# EAGLE design swiatlo (EAGLE 7.5.0)
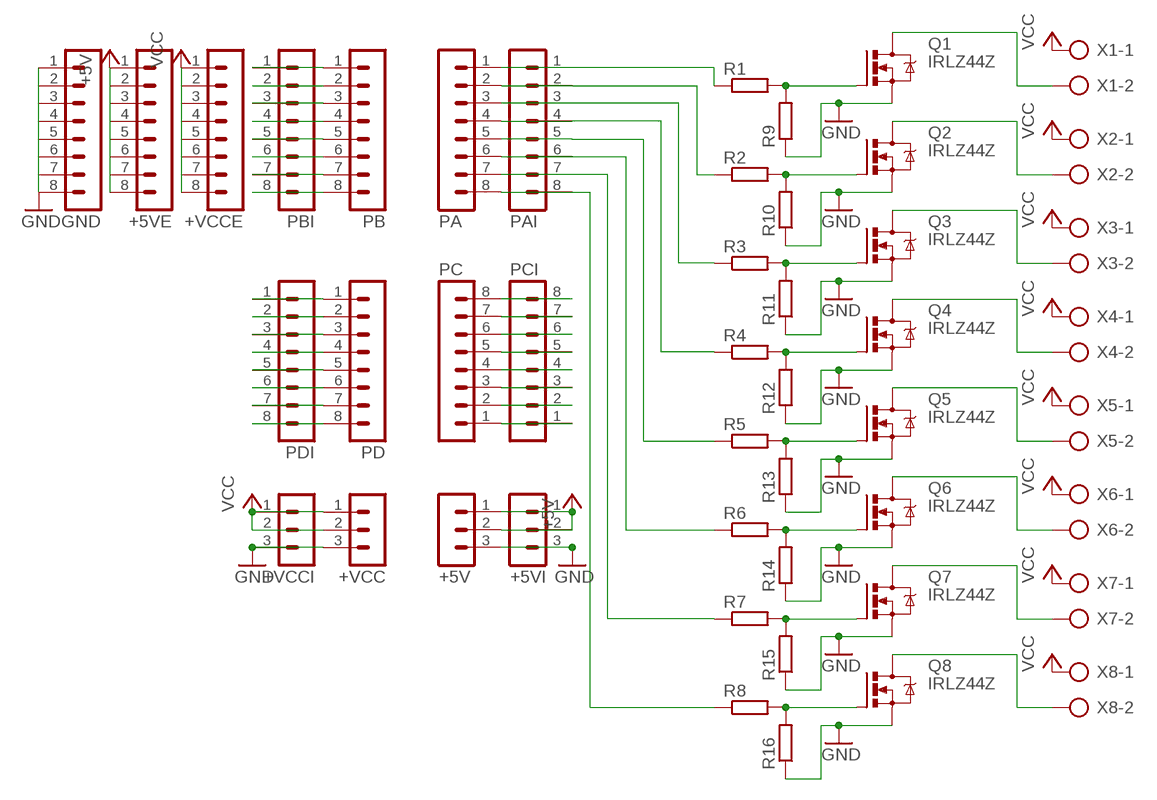
[diagram p0: schematic, sheet 1]

## Parts
+5V  MA03-1  [MA03-1]
+5VE  MA08-1  [MA08-1]
+5VI  MA03-1  [MA03-1]
+VCC  MA03-1  [MA03-1]
+VCCE  MA08-1  [MA08-1]
+VCCI  MA03-1  [MA03-1]
GND  MA08-1  [MA08-1]
PA  MA08-1  [MA08-1]
PAI  MA08-1  [MA08-1]
PB  MA08-1  [MA08-1]
PBI  MA08-1  [MA08-1]
PC  MA08-1  [MA08-1]
PCI  MA08-1  [MA08-1]
PD  MA08-1  [MA08-1]
PDI  MA08-1  [MA08-1]
Q1  IRLZ44Z  [TO220BH]
Q2  IRLZ44Z  [TO220BH]
Q3  IRLZ44Z  [TO220BH]
Q4  IRLZ44Z  [TO220BH]
Q5  IRLZ44Z  [TO220BH]
Q6  IRLZ44Z  [TO220BH]
Q7  IRLZ44Z  [TO220BH]
Q8  IRLZ44Z  [TO220BH]
R1  R-EU_0204/7  [0204/7]
R2  R-EU_0204/7  [0204/7]
R3  R-EU_0204/7  [0204/7]
R4  R-EU_0204/7  [0204/7]
R5  R-EU_0204/7  [0204/7]
R6  R-EU_0204/7  [0204/7]
R7  R-EU_0204/7  [0204/7]
R8  R-EU_0204/7  [0204/7]
R9  R-EU_0204/7  [0204/7]
R10  R-EU_0204/7  [0204/7]
R11  R-EU_0204/7  [0204/7]
R12  R-EU_0204/7  [0204/7]
R13  R-EU_0204/7  [0204/7]
R14  R-EU_0204/7  [0204/7]
R15  R-EU_0204/7  [0204/7]
R16  R-EU_0204/7  [0204/7]
X1  AK300/2  [AK300/2]
X2  AK300/2  [AK300/2]
X3  AK300/2  [AK300/2]
X4  AK300/2  [AK300/2]
X5  AK300/2  [AK300/2]
X6  AK300/2  [AK300/2]
X7  AK300/2  [AK300/2]
X8  AK300/2  [AK300/2]

## Nets
+5V: +5V.1 +5V.2 +5VE.1 +5VE.2 +5VE.3 +5VE.4 +5VE.5 +5VE.6 +5VE.7 +5VE.8 +5VI.1 +5VI.2
GND: +5V.3 +5VI.3 +VCC.3 +VCCI.3 GND.1 GND.2 GND.3 GND.4 GND.5 GND.6 GND.7 GND.8 Q1.S Q2.S Q3.S Q4.S Q5.S Q6.S Q7.S Q8.S R9.1 R10.1 R11.1 R12.1 R13.1 R14.1 R15.1 R16.1
N$1: Q1.G R1.2 R9.2
N$2: Q2.G R2.2 R10.2
N$3: Q3.G R3.2 R11.2
N$4: Q4.G R4.2 R12.2
N$5: Q5.G R5.2 R13.2
N$6: Q6.G R6.2 R14.2
N$7: Q7.G R7.2 R15.2
N$8: Q8.G R8.2 R16.2
N$9: Q1.D X1.2
N$10: Q2.D X2.2
N$11: Q3.D X3.2
N$12: Q4.D X4.2
N$13: Q5.D X5.2
N$14: Q6.D X6.2
N$15: Q7.D X7.2
N$16: Q8.D X8.2
N$25: PC.8 PCI.8
N$26: PC.7 PCI.7
N$27: PC.6 PCI.6
N$28: PC.5 PCI.5
N$29: PC.4 PCI.4
N$30: PC.3 PCI.3
N$31: PC.2 PCI.2
N$32: PC.1 PCI.1
N$33: PA.1 PAI.1 R1.1
N$34: PA.2 PAI.2 R2.1
N$35: PA.3 PAI.3 R3.1
N$36: PA.4 PAI.4 R4.1
N$37: PA.5 PAI.5 R5.1
N$38: PA.6 PAI.6 R6.1
N$39: PA.7 PAI.7 R7.1
N$40: PA.8 PAI.8 R8.1
N$47: PD.8 PDI.8
N$48: PD.7 PDI.7
N$49: PD.6 PDI.6
N$50: PD.5 PDI.5
N$51: PD.4 PDI.4
N$52: PD.3 PDI.3
N$53: PD.2 PDI.2
N$54: PD.1 PDI.1
N$55: PB.8 PBI.8
N$56: PB.7 PBI.7
N$57: PB.6 PBI.6
N$58: PB.5 PBI.5
N$59: PB.4 PBI.4
N$60: PB.3 PBI.3
N$61: PB.2 PBI.2
N$62: PB.1 PBI.1
VCC: +VCC.1 +VCC.2 +VCCE.1 +VCCE.2 +VCCE.3 +VCCE.4 +VCCE.5 +VCCE.6 +VCCE.7 +VCCE.8 +VCCI.1 +VCCI.2 X1.1 X2.1 X3.1 X4.1 X5.1 X6.1 X7.1 X8.1

## Library data of the parts
+5V +5VI +VCC +VCCI = con-lstb:MA03-1: PIN HEADER; OC_FARNELL: unknown; OC_NEWARK: unknown
+5VE +VCCE GND PA PAI PB PBI PC PCI PD PDI = con-lstb:MA08-1: PIN HEADER; OC_FARNELL: unknown; OC_NEWARK: unknown
Q1-Q8 = transistor-power:IRLZ44Z: N-Channel HEXFET® Power MOSFET Logic Level AUTOMOTIVE MOSFET Source: http://www.irf.com/product-info/datasheets/data/irlz44zpbf.pdf
R1-R16 = rcl:R-EU_: RESISTOR, European symbol
X1-X8 = con-ptr500:AK300/2: CONNECTOR; OC_FARNELL: unknown; OC_NEWARK: unknown

## Board
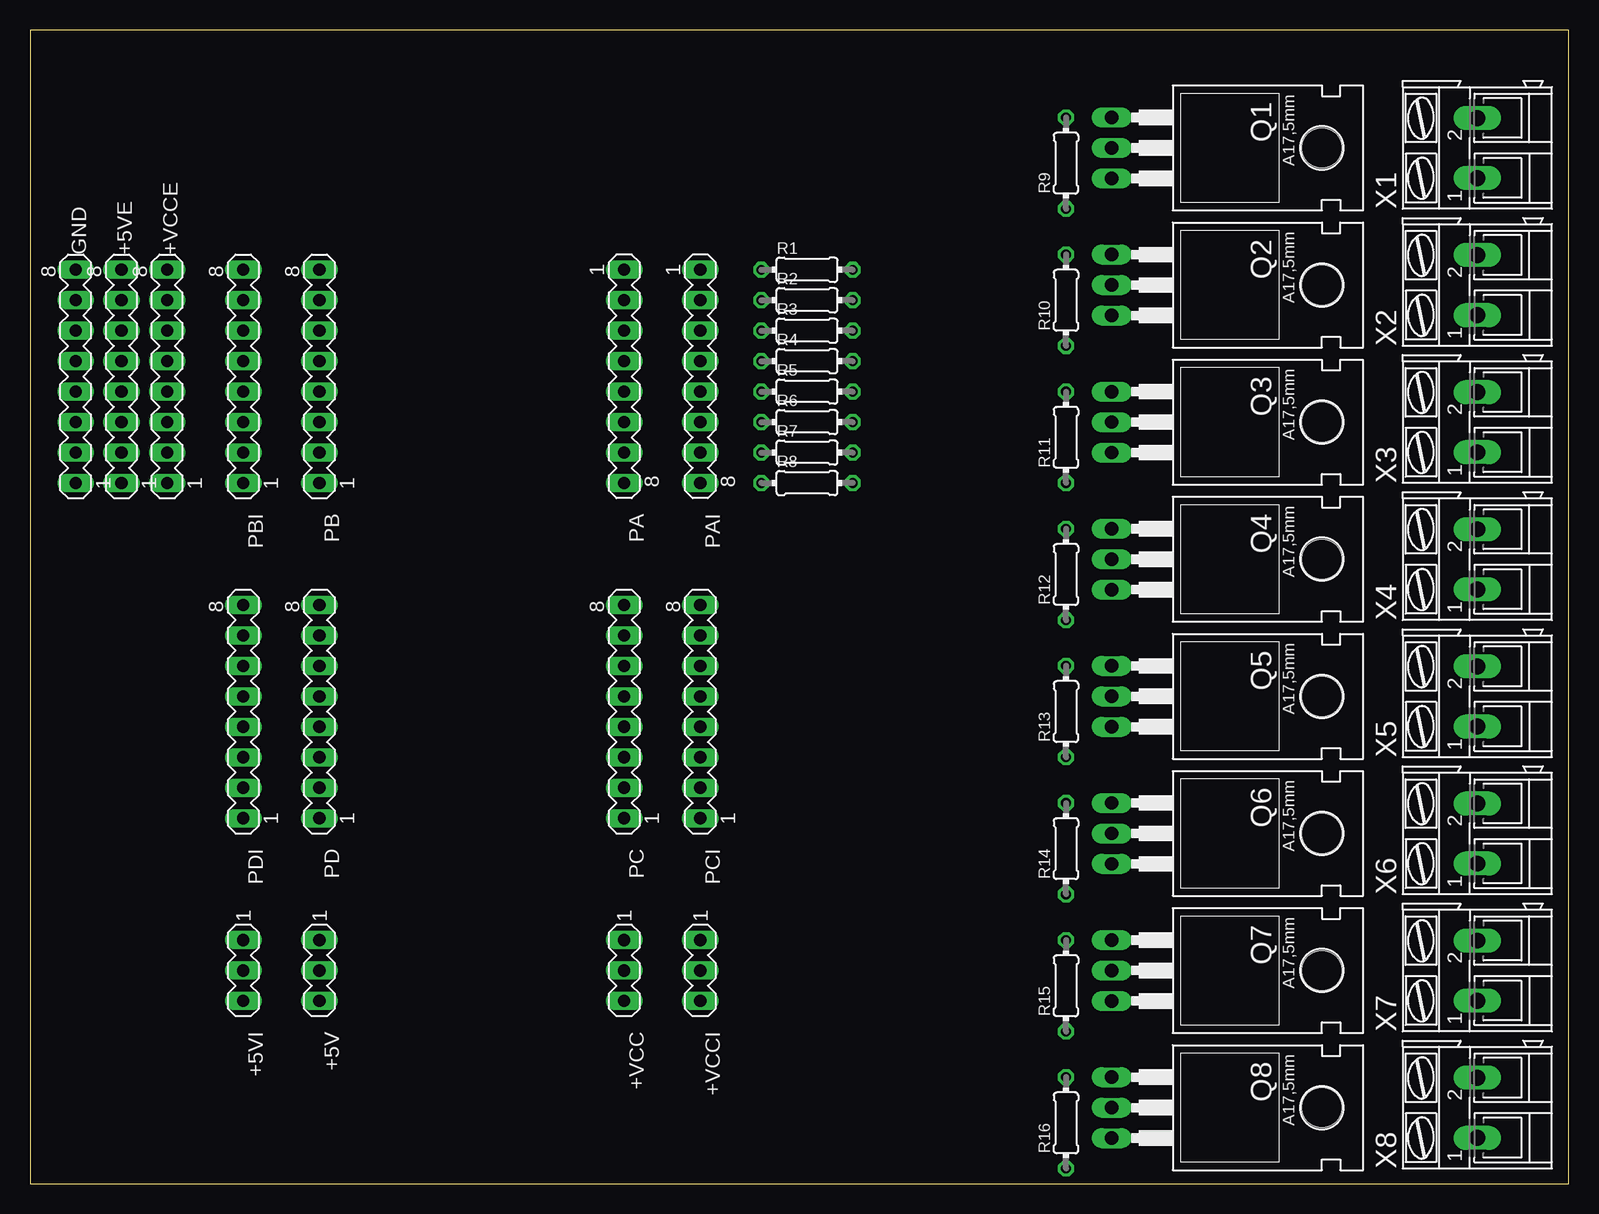
[diagram p1: board, top side]
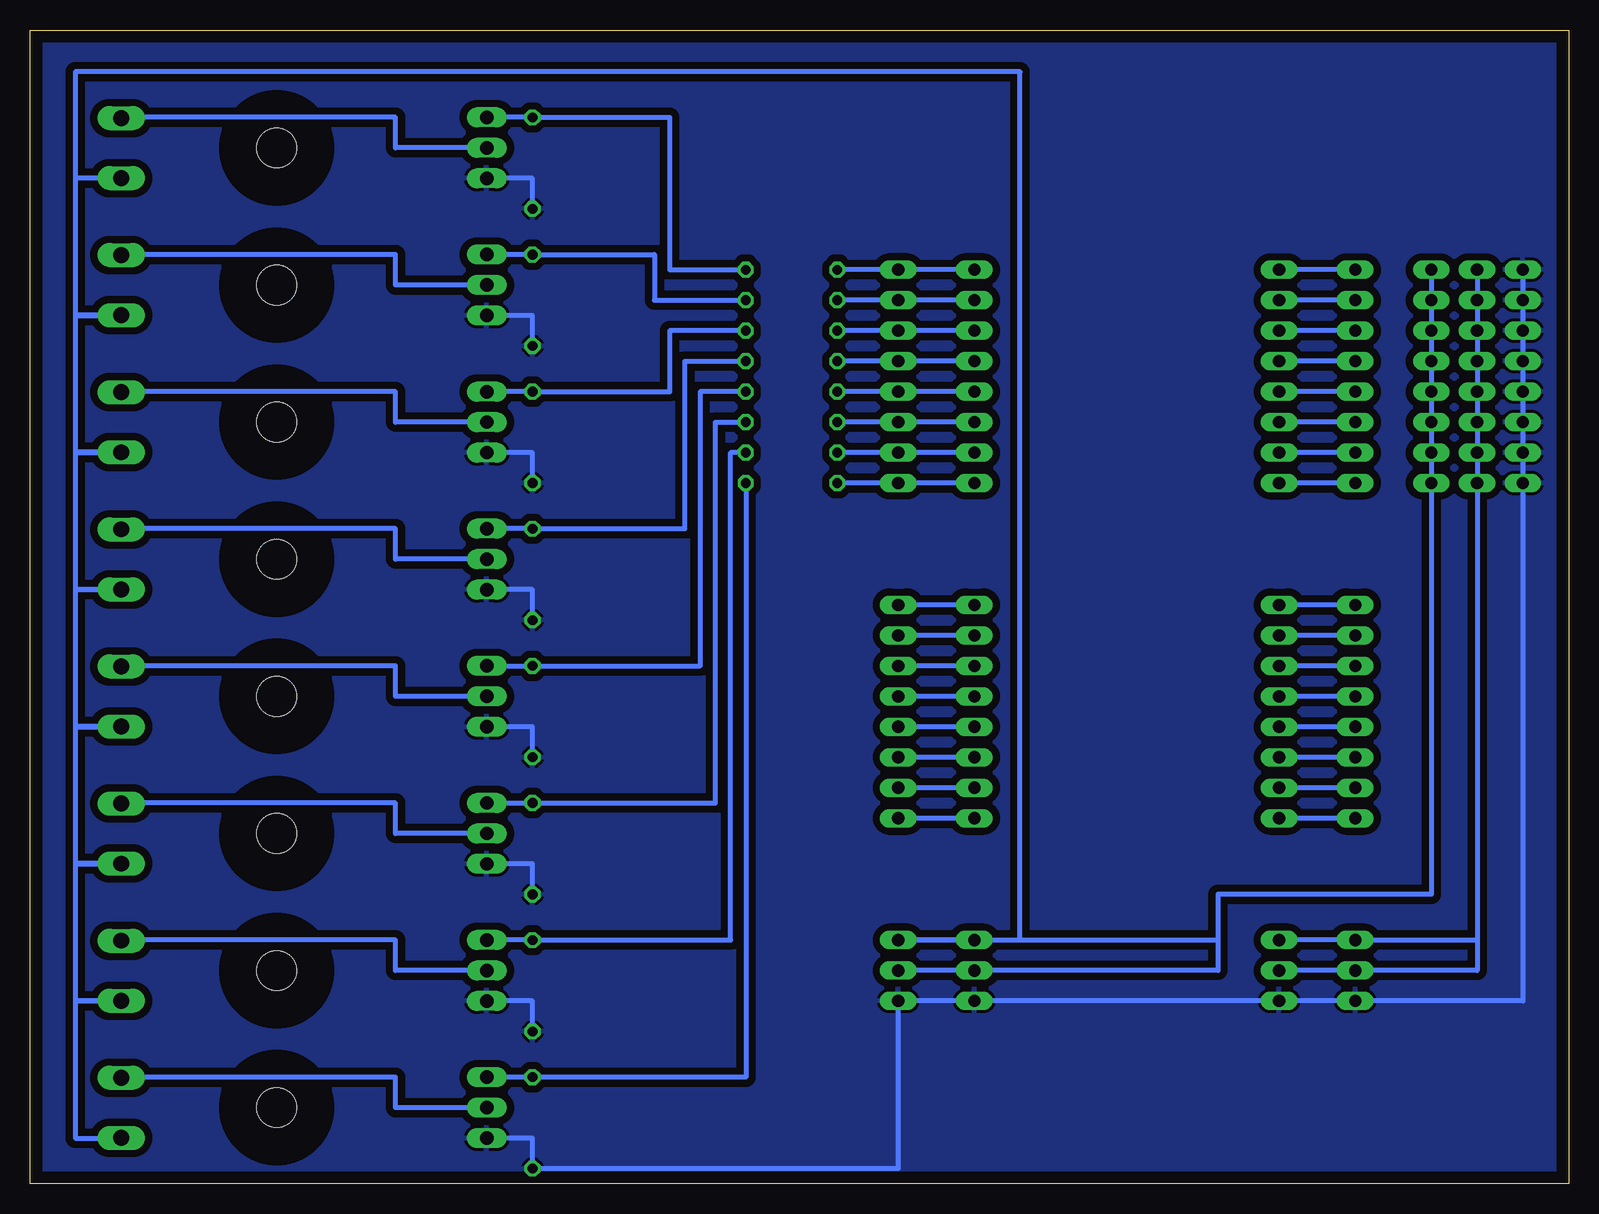
[diagram p2: board, bottom side, seen from below]

Size 128.25 x 96.19 mm. Coordinates in mm from the lower left corner, seen from the top.
Outline: 0,0 128.25,0 128.25,96.19 0,96.19 0,0
Copper layers (1*16): Top 0.035mm / dielectric 1.5mm / Bottom 0.035mm
Design rules "default": minimum track width 10mil, minimum drill 24mil, track to track 8mil, track to pad 8mil, pad to pad 8mil, via to via 8mil, smd to smd 8mil, copper to edge 40mil, drill to drill 8mil, minimum pad ring 10mil, minimum via ring 8mil, stop-mask expansion 4mil, vias tented up to drill 0mil, thermal gap 10mil

### Footprints (pad centres in the part's own frame; a part is rotated, then mirrored left to right if it is on the bottom)
MA03-1 = drill 1.016 long: 1 -2.54,0; 2 0,0; 3 2.54,0
MA08-1 = drill 1.016 long: 1 -8.89,0; 2 -6.35,0; 3 -3.81,0; 4 -1.27,0; 5 1.27,0; 6 3.81,0; 7 6.35,0; 8 8.89,0
TO220BH = drill 1.118 long: D 0,-6.35; G -2.54,-6.35; S 2.54,-6.35 | hole 3.302: 0,11.176
0204/7 = drill 0.813 octagon: 1 -3.81,0; 2 3.81,0
AK300/2 = drill 1.321 long: 1 -2.515,0; 2 2.489,0

### Placement (x,y rotation side)
+5V  24.13,17.78 270 top
+5VE  7.62,67.31 90 top
+5VI  17.78,17.78 270 top
+VCC  55.88,17.78 270 top
+VCCE  11.43,67.31 90 top
+VCCI  49.53,17.78 270 top
GND  3.81,67.31 90 top
PA  55.88,67.31 270 top
PAI  49.53,67.31 270 top
PB  24.13,67.31 90 top
PBI  17.78,67.31 90 top
PC  55.88,39.37 90 top
PCI  49.53,39.37 90 top
PD  24.13,39.37 90 top
PDI  17.78,39.37 90 top
Q1  96.52,86.36 270 top
Q2  96.52,74.93 270 top
Q3  96.52,63.5 270 top
Q4  96.52,52.07 270 top
Q5  96.52,40.64 270 top
Q6  96.52,29.21 270 top
Q7  96.52,17.78 270 top
Q8  96.52,6.35 270 top
R1  64.77,76.2 0 top
R2  64.77,73.66 0 top
R3  64.77,71.12 0 top
R4  64.77,68.58 0 top
R5  64.77,66.04 0 top
R6  64.77,63.5 0 top
R7  64.77,60.96 0 top
R8  64.77,58.42 0 top
R9  86.36,85.09 90 top
R10  86.36,73.66 90 top
R11  86.36,62.23 90 top
R12  86.36,50.8 90 top
R13  86.36,39.37 90 top
R14  86.36,27.94 90 top
R15  86.36,16.51 90 top
R16  86.36,5.08 90 top
X1  120.65,86.36 90 top
X2  120.65,74.93 90 top
X3  120.65,63.5 90 top
X4  120.65,52.07 90 top
X5  120.65,40.64 90 top
X6  120.65,29.21 90 top
X7  120.65,17.78 90 top
X8  120.65,6.35 90 top

### Tracks (layer width: path | path; a pad name or v marks a point on that pad's centre or on a via)
+5V
  Bottom 0.406: +5V.1 +5VI.1 7.62,20.32 | +5V.2 +5VI.2 7.62,17.78 7.62,20.32 | +5VE.8 +5VE.7 +5VE.6 +5VE.5 +5VE.4 +5VE.3 +5VE.2 +5VE.1 7.62,20.32
GND
  Bottom 0.406: +5VI.3 +5V.3 | +VCCI.3 +VCC.3 | GND.8 GND.7 GND.6 GND.5 GND.4 GND.3 GND.2 GND.1 3.81,15.24 +VCC.3 | R10.1 86.36,72.39 Q2.S | Q1.S 86.36,83.82 R9.1 | R11.1 86.36,60.96 Q3.S | +VCC.3 55.88,1.27 R16.1 86.36,3.81 Q8.S | R15.1 86.36,15.24 Q7.S | R14.1 86.36,26.67 Q6.S | R13.1 86.36,38.1 Q5.S | R12.1 86.36,49.53 Q4.S
  pour Bottom (isolate 0.61): 0,0 128.27,0 128.27,96.52 0,96.52
N$1
  Bottom 0.406: Q1.G R9.2 74.93,88.9 74.93,76.2 R1.2
N$2
  Bottom 0.406: Q2.G R10.2 76.2,77.47 76.2,73.66 R2.2
N$3
  Bottom 0.406: Q3.G R11.2 74.93,66.04 74.93,71.12 R3.2
N$4
  Bottom 0.406: Q4.G R12.2 73.66,54.61 73.66,68.58 R4.2
N$5
  Bottom 0.406: Q5.G R13.2 72.39,43.18 72.39,66.04 R5.2
N$6
  Bottom 0.406: Q6.G R14.2 71.12,31.75 71.12,63.5 R6.2
N$7
  Bottom 0.406: Q7.G R15.2 69.85,20.32 69.85,60.96 R7.2
N$8
  Bottom 0.406: R8.2 68.58,8.89 R16.2 Q8.G
N$9
  Bottom 0.406: Q1.D 97.79,86.36 97.79,88.9 120.65,88.9 X1.2
N$10
  Bottom 0.406: Q2.D 97.79,74.93 97.79,77.47 120.65,77.47 X2.2
N$11
  Bottom 0.406: Q3.D 97.79,63.5 97.79,66.04 120.65,66.04 X3.2
N$12
  Bottom 0.406: Q4.D 97.79,52.07 97.79,54.61 120.65,54.61 X4.2
N$13
  Bottom 0.406: Q5.D 97.79,40.64 97.79,43.18 120.65,43.18 X5.2
N$14
  Bottom 0.406: Q6.D 97.79,29.21 97.79,31.75 120.65,31.75 X6.2
N$15
  Bottom 0.406: Q7.D 97.79,17.78 97.79,20.32 120.65,20.32 X7.2
N$16
  Bottom 0.406: Q8.D 97.79,6.35 97.79,8.89 120.65,8.89 X8.2
N$25
  Bottom 0.406: PCI.8 PC.8
N$26
  Bottom 0.406: PCI.7 PC.7
N$27
  Bottom 0.406: PCI.6 PC.6
N$28
  Bottom 0.406: PCI.5 PC.5
N$29
  Bottom 0.406: PCI.4 PC.4
N$30
  Bottom 0.406: PCI.3 PC.3
N$31
  Bottom 0.406: PCI.2 PC.2
N$32
  Bottom 0.406: PCI.1 PC.1
N$33
  Bottom 0.406: R1.1 PA.1 PAI.1
N$34
  Bottom 0.406: PAI.2 PA.2 R2.1
N$35
  Bottom 0.406: R3.1 PA.3 PAI.3
N$36
  Bottom 0.406: R4.1 PA.4 PAI.4
N$37
  Bottom 0.406: R5.1 PA.5 PAI.5
N$38
  Bottom 0.406: R6.1 PA.6 PAI.6
N$39
  Bottom 0.406: R7.1 PA.7 PAI.7
N$40
  Bottom 0.406: PAI.8 PA.8 R8.1
N$47
  Bottom 0.406: PDI.8 PD.8
N$48
  Bottom 0.406: PDI.7 PD.7
N$49
  Bottom 0.406: PDI.6 PD.6
N$50
  Bottom 0.406: PDI.5 PD.5
N$51
  Bottom 0.406: PDI.4 PD.4
N$52
  Bottom 0.406: PDI.3 PD.3
N$53
  Bottom 0.406: PDI.2 PD.2
N$54
  Bottom 0.406: PDI.1 PD.1
N$55
  Bottom 0.406: PBI.8 PB.8
N$56
  Bottom 0.406: PBI.7 PB.7
N$57
  Bottom 0.406: PBI.6 PB.6
N$58
  Bottom 0.406: PBI.5 PB.5
N$59
  Bottom 0.406: PBI.4 PB.4
N$60
  Bottom 0.406: PBI.3 PB.3
N$61
  Bottom 0.406: PBI.2 PB.2
N$62
  Bottom 0.406: PBI.1 PB.1
VCC
  Bottom 0.406: +VCC.2 +VCCI.2 29.21,17.78 29.21,20.32 | +VCCE.8 +VCCE.7 +VCCE.6 +VCCE.5 +VCCE.4 +VCCE.3 +VCCE.2 +VCCE.1 11.43,24.13 29.21,24.13 29.21,20.32 | 29.21,20.32 +VCCI.1 +VCC.1 45.72,20.32 45.72,92.71 124.46,92.71 124.46,83.84 | X1.1 124.46,83.84 | 124.46,83.84 124.46,72.39 120.65,72.39 X2.1 124.46,72.41 124.46,60.96 120.65,60.96 X3.1 124.46,60.99 124.46,49.55 | 124.46,49.53 120.65,49.53 X4.1 124.46,49.55 | 124.46,49.55 124.46,49.53 | 124.46,49.53 124.46,38.1 120.65,38.1 X5.1 124.46,38.12 124.46,26.67 120.65,26.67 X6.1 124.46,26.69 124.46,15.24 120.65,15.24 X7.1 124.46,15.27 124.46,3.81 120.65,3.81 X8.1